# Altium schematic sheet pedal_main.SchDoc
size B; SheetNumber: 1; SheetTotal: 2
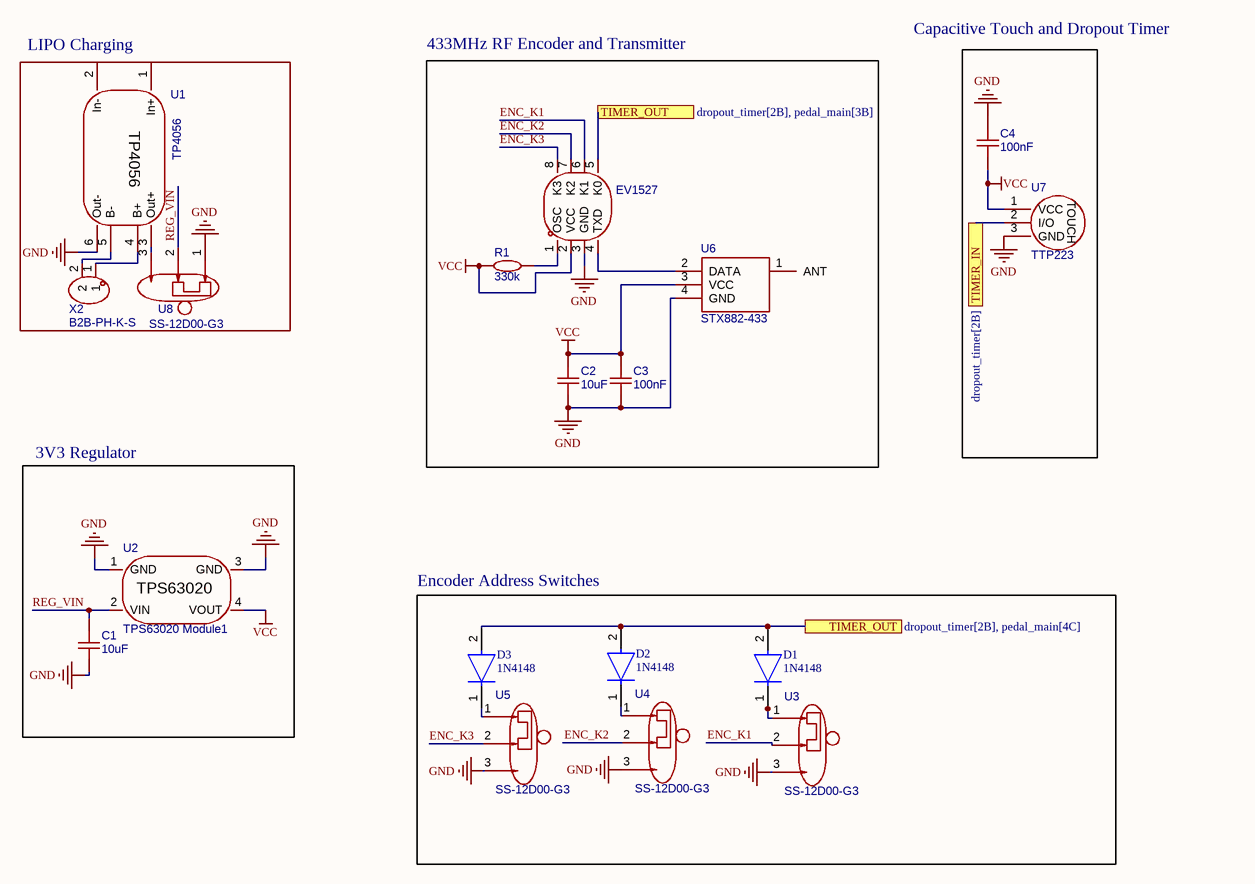
[diagram p0: pedal_main.SchDoc]

## Parts
?  EV1527  [SOP-8_L4.9-W3.9-P1.27-LS6.0-TL]
C1  10uF  [C0603]
C2  10uF  [C0603]
C3  100nF  [C0603]
C4  100nF  [C0603]
D1  1N4148  [FP-017AG-MFG]
D2  1N4148  [FP-017AG-MFG]
D3  1N4148  [FP-017AG-MFG]
R1  330k  [R0603]
U1  TP4056  [BATTMODULE]
U2  TPS63020 Module1  [TPS63020 MODULE AIOT]
U3  SS-12D00-G3  [SW-TH_3P-L8.8-W3.9-P2.50_SS12D00G3]
U4  SS-12D00-G3  [SW-TH_3P-L8.8-W3.9-P2.50_SS12D00G3]
U5  SS-12D00-G3  [SW-TH_3P-L8.8-W3.9-P2.50_SS12D00G3]
U6  STX882-433  [STX882_NiceRF_12x15.2]
U7  TTP223  [TTP223]
U8  SS-12D00-G3  [SW-TH_3P-L8.8-W3.9-P2.50_SS12D00G3]
X2  B2B-PH-K-S  [CONN-TH_B2B-PH-K-S]

## Blocks framed on the sheet
433MHz RF Encoder and Transmitter: ? C2 C3 R1 U6
LIPO Charging: U1 U8 X2
3V3 Regulator: C1 U2
Encoder Address Switches: D1-D3 U3-U5

## Ports
TIMER_IN (see dropout_timer[2B]), TIMER_OUT (see dropout_timer[2B], pedal_main[3B]), TIMER_OUT (see dropout_timer[2B], pedal_main[4C])

## Nets
GND: ?.3(GND) C1.2 C2.2 C3.2 C4.2 U1.6(Out-) U2.1(GND) U2.3(GND) U3.3 U4.3 U5.3 U6.4(GND) U7.3(GND) U8.1
VCC: ?.2(VCC) C2.1 C3.1 C4.1 R1.1 U2.4(VOUT) U6.3(VCC) U7.1(VCC)
ENC_K1: ?.6(K1) U3.2
ENC_K2: ?.7(K2) U4.2
ENC_K3: ?.8(K3) U5.2
REG_VIN: C1.1 U2.2(VIN) U8.2
TIMER_IN: U7.2(I/O) ; port TIMER_IN
TIMER_OUT: ?.5(K0) D1.2(A) D2.2(A) D3.2(A) ; port TIMER_OUT
Net?_1: ?.1(OSC) R1.2
Net?_4: ?.4(TXD) U6.2(DATA)
NetD1_1: D1.1(C) U3.1
NetD2_1: D2.1(C) U4.1
NetD3_1: D3.1(C) U5.1
NetU1_3: U1.3(Out+) U8.3
NetU1_4: U1.4(B+) X2.1
NetU1_5: U1.5(B-) X2.2

Not connected (* = marked no-connect by the designer): U1 1(In+) 2(In-); U6 1(ANT)

## Notes on the sheet
- Capacitive Touch and Dropout Timer
- DWG. NO.
- REV.
- SHT.
- THIS DOCUMENT AND THE DATA DISCLOSED HEREIN OR HEREWITH IS THE PROPERTY OF ALTIUM LIMITED AND MAY BE FREELY DISTRIBUTED IN WHOLE. NO RIGHTS ARE RESERVED OR EXPRESS OR IMPLIED WARANTEE GIVEN.
- REVISION
- DESCRIPTION
- DATE
- APPROVED
- ENG:
- APPROVALS
- PROJECT
- DSN:
- CHK:
- REFERENCE DOCUMENTS
- PROJECT REVISION:
- TITLE
- DOCUMENT REVISION:
- DESIGN ITEM:
- BOM:
- FAB DWG:
- PCB DWG:
- ASSY DWG:
- SCALE:
- SIZE
- B
- CAGE CODE
- FILE NAME
- DWG NO.
- SHEET
- OF
- REV
- (in symbol TTP223) TOUCH

## Library data of the parts
? = EV1527: Symbol: EV1527_C2764439; AddInBom: yes; ModelId: 1637369e3845406d90068fbde42645d6ÂŽ0819f05c4eef4c71ace90d822a990e87; ModelName: SOP-8_L4.9-W3.9-H1.45-LS6.0-P1.27; ModelTransform: 236.22,189.751,0,0,0,0,-0.005,0.003,0; Device: EV1527; LCSC Part Name: EV1527; SupplierPart: C2764439; ManufacturerPart: EV1527; Supplier Footprint: SOP-8; JLCPCB Part Class: Extended Part; Supplier: LCSC; ConvertToPcb: yes; FootprintName: SOP-8_L4.9-W3.9-P1.27-LS6.0-TL
C1 C2 = CAP_0603: Symbol: CAP_OLD; ConvertToPcb: yes; ModelId: 624118aa3cc7497086c383c2d72e0852ÂŽ0819f05c4eef4c71ace90d822a990e87; ModelName: C0603_L1.6-W0.8-H0.8; ModelTransform: 62.992,31.496,0,0,0,0,0,0,0; Device: CAP_0603; Value: 10uF; AddInBom: yes; Supplier Footprint: 0603; FootprintName: C0603
C3 C4 = CAP_0603_1: Symbol: CAP_OLD; ConvertToPcb: yes; ModelId: 624118aa3cc7497086c383c2d72e0852ÂŽ0819f05c4eef4c71ace90d822a990e87; ModelName: C0603_L1.6-W0.8-H0.8; ModelTransform: 62.992,31.496,0,0,0,0,0,0,0; Device: CAP_0603; AddInBom: yes; Supplier Footprint: 0603; FootprintName: C0603; Value: 100nF
D1-D3 = CMP-07163-000046-1: DIODE GEN PURP 100V 200MA DO35; Forward Voltage: 1V; Max Power Dissipation: 500mW; Max Reverse Current: 5uA; Forward Current: 300mA; Current: 4A; Reverse Recovery Time: 4ns; Element Configuration: Single; Outside Diameter: 1.85mm; Capacitance: 4pF; Polarity: Standard; Max Forward Surge Current (Ifsm): 1A; Reverse Voltage: 100V; Output Current: 200mA; Average Rectified Current: 200mA; Diameter: 1.91mm; Max Repetitive Reverse Voltage (Vrrm): 100V; Current Rating: 200mA; Case/Package: DO-35; Lead Free: Lead Free; Number of Pins: 2; Recovery Time: 4ns; Packaging: Bulk; Contact Plating: Tin; Voltage: 100V; Mount: Through Hole; Max Surge Current: 4A; Package Quantity: 2000; Width: 1.91mm; Max Reverse Voltage (DC): 100V; Length: 4.56mm; Radiation Hardening: No; Power Dissipation: 500mW; Voltage Rating (DC): 100V; Peak Non-Repetitive Surge Current: 4A; REACH SVHC: No SVHC; Height: 4.56mm; Max Operating Temperature: 175°C; Series: -; Weight: 0.01lb; Min Operating Temperature: -65°C
R1 = Res_0603: Symbol: Res; ConvertToPcb: yes; ModelId: 112863783b5b41f1b5254f87eedc7932ÂŽ0819f05c4eef4c71ace90d822a990e87; ModelTransform: 31.8897,63.7794,0,90,0,0,0,0,0; Device: Res_0603; Value: 330k; AddInBom: yes; Supplier Footprint: 0603; FootprintName: R0603; ModelName: R0603
U1 = TP4056: ManufacturerPart: TP4056 Lithium Battery Charger Module; AddInBom: yes; ModelId: e423d71e48284fa8aca64bd540eddcc7ÂŽ12eb6a14b26044868d603fa342c20fc9; ModelTransform: 1123.969599391241,677.16402,166.0550894347883,0,0,0,519.68504,330.70866,0; Symbol: TP4056; Device: TP4056; ConvertToPcb: yes; FootprintName: BATTMODULE; ModelName: TP4056
U2 = TPS63020: TPS63020 (Buck-Boost); AddInBom: yes; Symbol: TPS63020; Device: TPS63020; ConvertToPcb: yes; FootprintName: TPS63020 MODULE AIOT
U3-U5 U8 = SS-12D00-G3: Circuit:SPDT Actuator Style:Rectangular Columnar Termination Style:PC Pin Length:8.8mm Width:3.9mm Switch Height:7.2mm Mounting Type:Through Hole Actuator Color:Black Operating Temperature:-35℃~+75℃ Operating Temperature:-35℃~+75℃; Manufacturer: SOFNG(硕方); AddInBom: yes; ModelId: 73abde54055d465790e8480c42fb2657ÂŽ0819f05c4eef4c71ace90d822a990e87; ModelTransform: 346.495,153.54304,0,0,0,0,0,0,-102.362; Circuit: SPDT; Switch Height: 7.2mm; Actuator Color: Black; Symbol: SS-12D00-G3; Device: SS-12D00-G3; LCSC Part Name: 大型拨动开关; SupplierPart: C22355741; ManufacturerPart: SS-12D00-G3; Supplier Footprint: 插件-3P,8.8x3.9mm; JLCPCB Part Class: Extended Part; Datasheet: https://item.szlcsc.com/datasheet/SS-12D00-G3/23787622.html; Supplier: LCSC; ConvertToPcb: yes; FootprintName: SW-TH_3P-L8.8-W3.9-P2.50_SS12D00G3; ModelName: SW-TH_3P-L8.8-W3.9-P2.50_SS12D00G3; Actuator Style: Rectangular Columnar; Termination Style: PC Pin; Length: 8.8mm; Width: 3.9mm; Mounting Type: Through Hole; Operating Temperature: -35℃~+75℃
U6 = STX882-433: NiceRF STX882 433.92MHz ASK/OOK transmitter, 12.00x15.20mm, 3x2.54mm header + corner ANT pad; Symbol: STX882_NiceRF; ModelTransform: 0, 0, 0, 0, 0, 0, 0, 0, 0; AddInBom: yes; Device: STX882-433; ConvertToPcb: yes; FootprintName: STX882_NiceRF_12x15.2
U7 = TTP223: AddInBom: yes; ModelId: d48ae1b8fed1494d82694b8c5cf2b6f8ÂŽ0819f05c4eef4c71ace90d822a990e87; ModelName: COMM-TH_L15.0-W11.0_TTP223; ModelTransform: 590.54,433.06,295.27,90,0,0,0,0,0; Symbol: TTP223; Device: TTP223; ConvertToPcb: yes; FootprintName: TTP223
X2 = B2B-PH-K-S: Pins Structure:1x2P Pitch:2mm Mounting Style:Direct Insert Reference Series:PH Number of Pins:2P Number of Rows:1 Number of PINs Per Row:2 Row Spacing:- Current Rating (Max):2A Contact Material:Brass Contact Plating:Tin Operating Temperature Range:-25℃~+8; Manufacturer: JST; AddInBom: yes; ModelId: 5cc63648eb1041ff813a836ee0942c91ÂŽ0819f05c4eef4c71ace90d822a990e87; ModelName: CONN-TH_PH2.00-LI-2P; ModelTransform: 236.25937,181.102,0,180,0,0,0,23.622,-137.795; Pins Structure: 1x2P; Pitch: 2mm; Reference Series: PH; Number of PINs Per Row: 2; Current Rating (Max): 2A; Rated Voltage (Max): 100V; Plastic Material: PA66; Flame Retardant Rating: UL94V-0; Supplementary Features: K-leg punch; Z-Height of the Board: 6mm; X-Length of Bottom Edge on Board (Spacing Line): 5.9mm; Y-Width of Bottom Edge on Board: 4.5mm; Symbol: B2B-PH-K-S; Device: B2B-PH-K-S; LCSC Part Name: 1x2P 间距:2mm 直插 系列:PH; SupplierPart: C20504437; ManufacturerPart: B2B-PH-K-S; Supplier Footprint: 插件,P=2mm; JLCPCB Part Class: Extended Part; Datasheet: https://atta.szlcsc.com/upload/public/pdf/source/20181010/C265101_22107ACC4D8714694FDA2DD97145FA81.pdf; Supplier: LCSC; ConvertToPcb: yes; FootprintName: CONN-TH_B2B-PH-K-S; Mounting Style: Direct Insert; Number of Pins: 2P; Number of Rows: 1; Row Spacing: -; Contact Material: Brass; Contact Plating: Tin; Operating Temperature Range: -25℃~+85℃; Colour: White